# Altium schematic sheet downloader.SchDoc
size A3; SheetNumber: 1; SheetTotal: 1
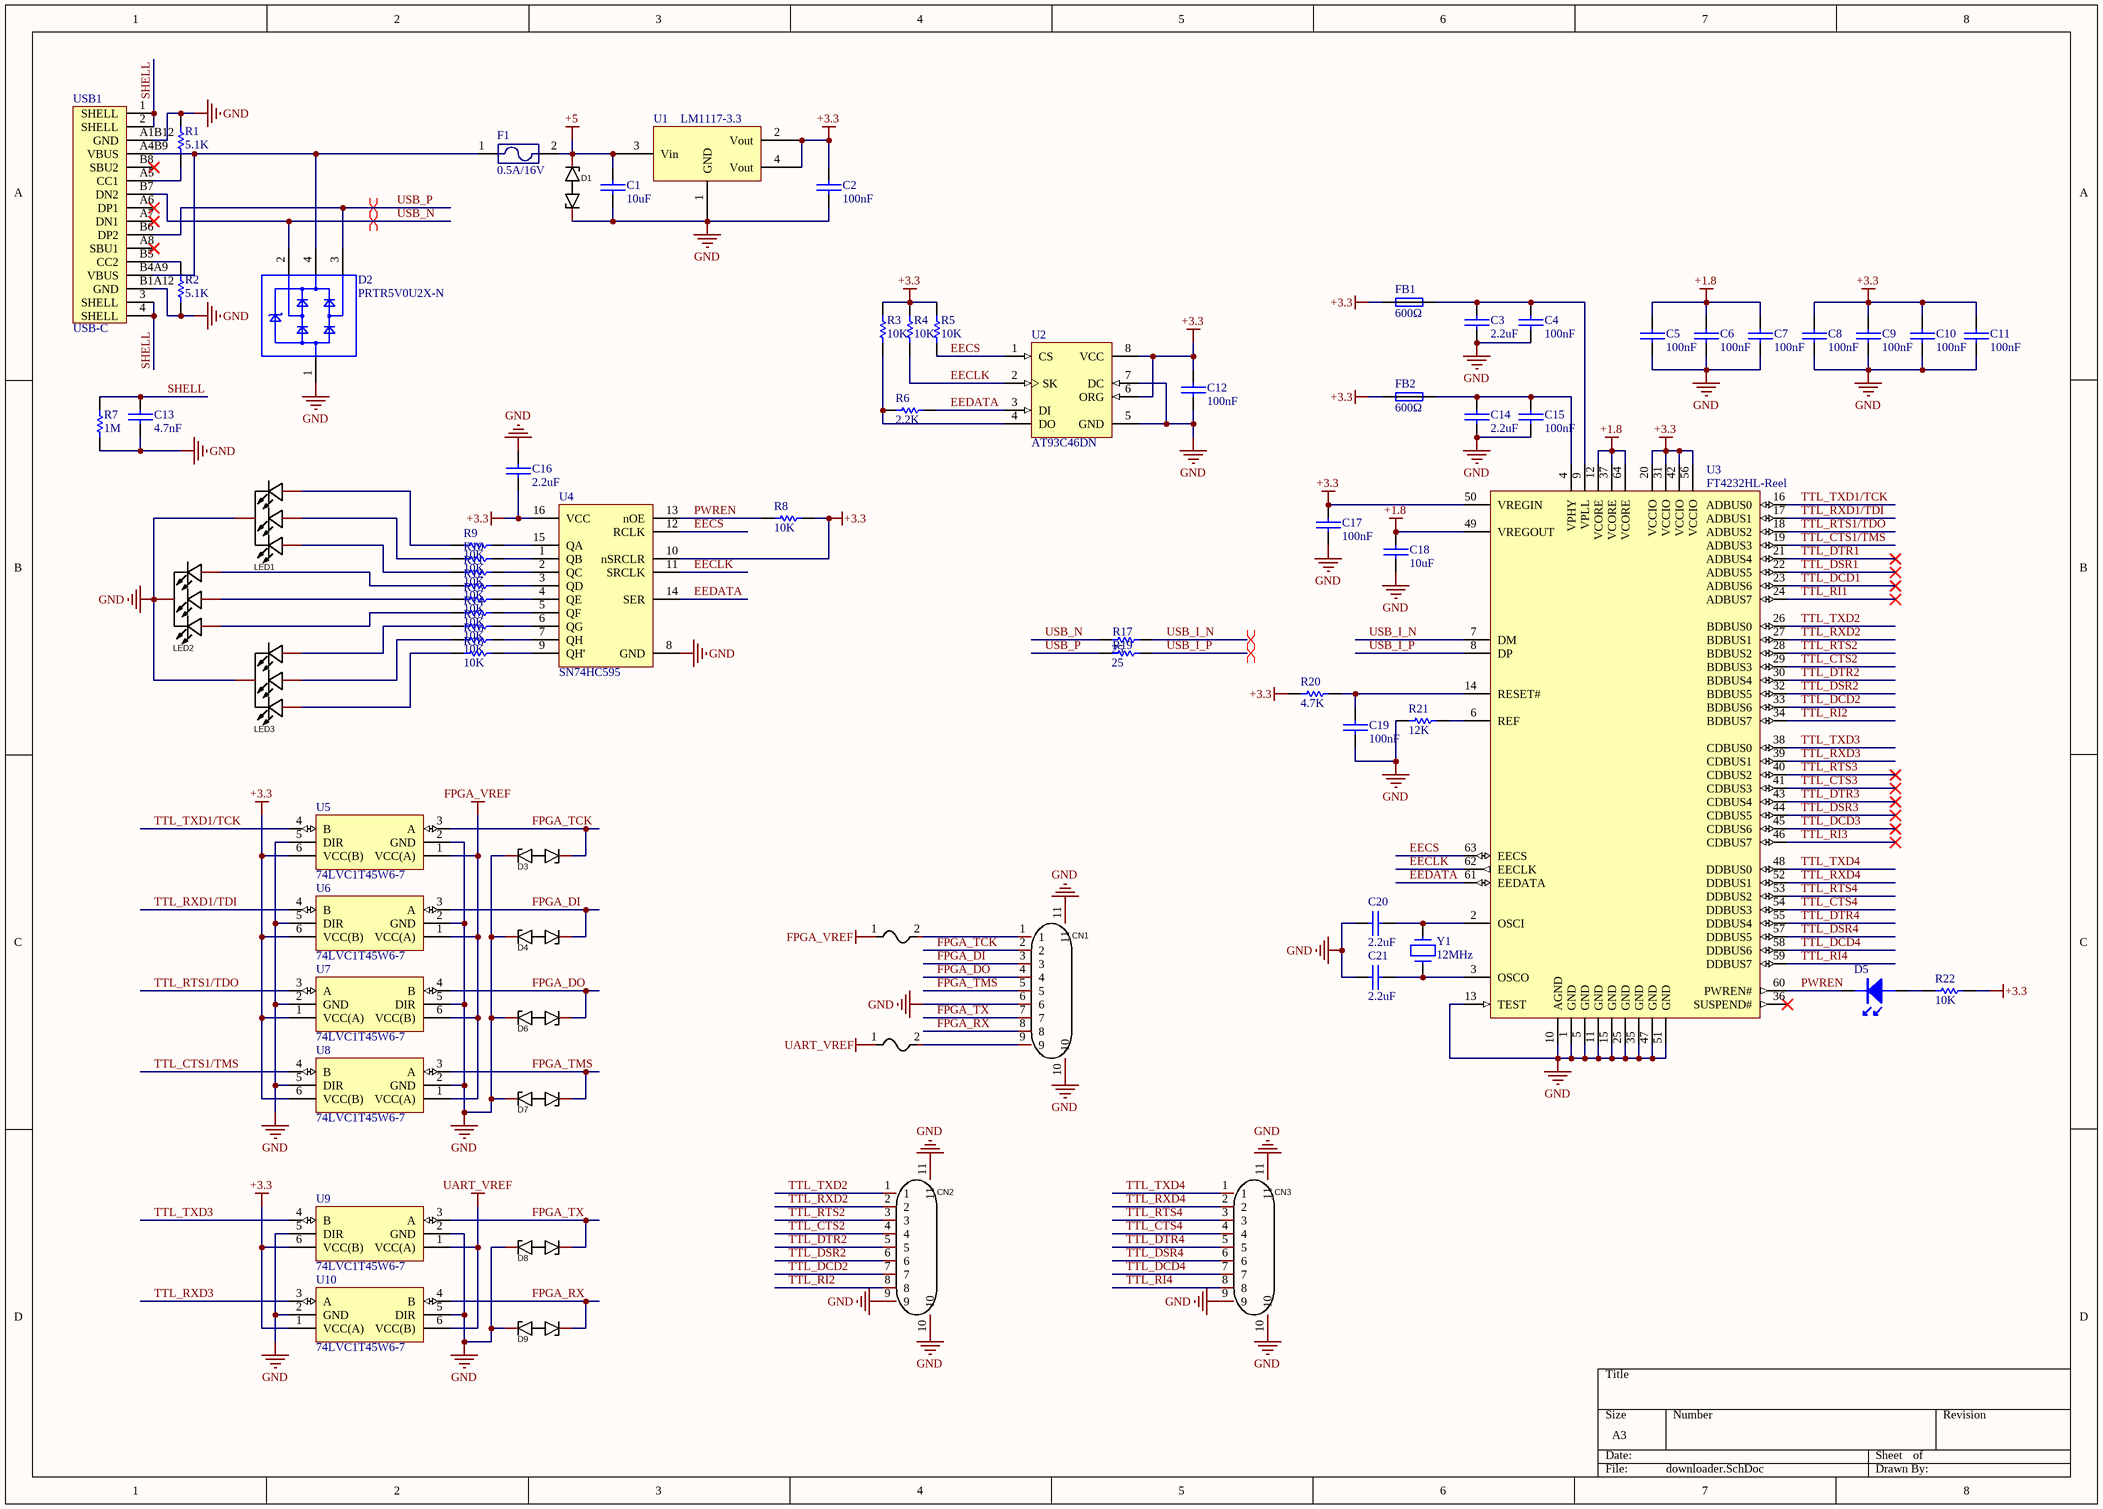
[diagram p0: downloader.SchDoc]

## Parts
C1  10uF  [CAP-0603]
C2  100nF  [CAP-0603]
C3  2.2uF  [CAP-0603]
C4  100nF  [CAP-0603]
C5  100nF  [CAP-0603]
C6  100nF  [CAP-0603]
C7  100nF  [CAP-0603]
C8  100nF  [CAP-0603]
C9  100nF  [CAP-0603]
C10  100nF  [CAP-0603]
C11  100nF  [CAP-0603]
C12  100nF  [CAP-0603]
C13  4.7nF  [CAP-0603]
C14  2.2uF  [CAP-0603]
C15  100nF  [CAP-0603]
C16  2.2uF  [CAP-0603]
C17  100nF  [CAP-0603]
C18  10uF  [CAP-0603]
C19  100nF  [CAP-0603]
C20  2.2uF  [CAP-0603]
C21  2.2uF  [CAP-0603]
CN1  1.25-9PWT  [CONN-SMD_1.25-9PWT]  (value not drawn)
CN2  1.25-9PWT  [CONN-SMD_1.25-9PWT]  (value not drawn)
CN3  1.25-9PWT  [CONN-SMD_1.25-9PWT]  (value not drawn)
D1  PESD5V0S1BA,115  [SOD-323]  (value not drawn)
D2  PRTR5V0U2X-N  [SOT-143]
D3  PESD5V0S1BA,115  [SOD-323]  (value not drawn)
D4  PESD5V0S1BA,115  [SOD-323]  (value not drawn)
D5  (no value)  [LED-0603]
D6  PESD5V0S1BA,115  [SOD-323]  (value not drawn)
D7  PESD5V0S1BA,115  [SOD-323]  (value not drawn)
D8  PESD5V0S1BA,115  [SOD-323]  (value not drawn)
D9  PESD5V0S1BA,115  [SOD-323]  (value not drawn)
F1  0.5A/16V  [F-1206]
F2  BSMD0805-050-6V  [F-0805]  (value not drawn)
F3  BSMD0805-050-6V  [F-0805]  (value not drawn)
FB1  600Ω  [FB-0603]
FB2  600Ω  [FB-0603]
LED1  TJ-S1615CY6TGLCCSRGB-A5  [LED-SMD_4P]  (value not drawn)
LED2  TJ-S1615CY6TGLCCSRGB-A5  [LED-SMD_4P]  (value not drawn)
LED3  TJ-S1615CY6TGLCCSRGB-A5  [LED-SMD_4P]  (value not drawn)
R1  5.1K  [RES-0603]
R2  5.1K  [RES-0603]
R3  10K  [RES-0603]
R4  10K  [RES-0603]
R5  10K  [RES-0603]
R6  2.2K  [RES-0603]
R7  1M  [RES-0603]
R8  10K  [RES-0603]
R9  10K  [RES-0603]
R10  10K  [RES-0603]
R11  10K  [RES-0603]
R12  10K  [RES-0603]
R13  10K  [RES-0603]
R14  10K  [RES-0603]
R15  10K  [RES-0603]
R16  10K  [RES-0603]
R17  25  [RES-0603]
R18  10K  [RES-0603]
R19  25  [RES-0603]
R20  4.7K  [RES-0603]
R21  12K  [RES-0603]
R22  10K  [RES-0603]
U1  LM1117-3.3  [SOT-223]
U2  AT93C46DN  [SO-8]
U3  FT4232HL-Reel  [LQFP-64]
U4  SN74HC595  [SO-16]
U5  74LVC1T45W6-7  [SOT-23-6]
U6  74LVC1T45W6-7  [SOT-23-6]
U7  74LVC1T45W6-7  [SOT-23-6]
U8  74LVC1T45W6-7  [SOT-23-6]
U9  74LVC1T45W6-7  [SOT-23-6]
U10  74LVC1T45W6-7  [SOT-23-6]
USB1  USB-C  [USB-C]
Y1  12MHz  [XTAL-49/S_N]

## Nets
+1.8: C5.2 C6.2 C7.2 C18.2 U3.12(VCORE) U3.37(VCORE) U3.49(VREGOUT) U3.64(VCORE)
+3.3: C2.2 C8.2 C9.2 C10.2 C11.2 C12.2 C16.2 C17.2 FB1.1 FB2.1 R3.1 R4.1 R5.1 R8.2 R20.1 R22.2 U1.2(Vout) U1.4(Vout) U2.6(ORG) U2.8(VCC) U3.20(VCCIO) U3.31(VCCIO) U3.42(VCCIO) U3.50(VREGIN) U3.56(VCCIO) U4.10(nSRCLR) U4.16(VCC) U5.6(VCC(B)) U6.6(VCC(B)) U7.1(VCC(A)) U8.6(VCC(B)) U9.6(VCC(B)) U10.1(VCC(A))
+5: C1.2 D1.2 F1.2 U1.3(Vin)
FPGA_VREF: F2.1 U5.1(VCC(A)) U6.1(VCC(A)) U7.6(VCC(B)) U8.1(VCC(A))
GND: C1.1 C2.1 C3.1 C4.1 C5.1 C6.1 C7.1 C8.1 C9.1 C10.1 C11.1 C12.1 C13.1 C14.1 C15.1 C16.1 C17.1 C18.1 C19.1 C20.1 C21.1 CN1.6 CN1.10 CN1.11 CN2.9 CN2.10 CN2.11 CN3.9 CN3.10 CN3.11 D1.1 D2.1 D3.1 D4.1 D6.1 D7.1 D8.1 D9.1 LED1.1(C) LED2.1(C) LED3.1(C) R1.2 R2.1 R7.1 R21.1 U1.1(GND) U2.5(GND) U2.7(DC) U3.1(GND) U3.5(GND) U3.10(AGND) U3.11(GND) U3.13(TEST) U3.15(GND) U3.25(GND) U3.35(GND) U3.47(GND) U3.51(GND) U4.8(GND) U5.2(GND) U5.5(DIR) U6.2(GND) U6.5(DIR) U7.2(GND) U7.5(DIR) U8.2(GND) U8.5(DIR) U9.2(GND) U9.5(DIR) U10.2(GND) U10.5(DIR) USB1.A1B12(GND) USB1.B1A12(GND)
UART_VREF: F3.1 U9.1(VCC(A)) U10.6(VCC(B))
EECLK: R4.2 U2.2(SK) U3.62(EECLK) U4.11(SRCLK)
EECS: R5.2 U2.1(CS) U3.63(EECS) U4.12(RCLK)
EEDATA: R6.2 U2.3(DI) U3.61(EEDATA) U4.14(SER)
FPGA_DI: CN1.3 D4.2 U6.3(A)
FPGA_DO: CN1.4 D6.2 U7.4(B)
FPGA_RX: CN1.8 D9.2 U10.4(B)
FPGA_TCK: CN1.2 D3.2 U5.3(A)
FPGA_TMS: CN1.5 D7.2 U8.3(A)
FPGA_TX: CN1.7 D8.2 U9.3(A)
PWREN: D5.1 R8.1 U3.60(PWREN#) U4.13(nOE)
SHELL: C13.2 R7.2 USB1.1(SHELL) USB1.2(SHELL) USB1.3(SHELL) USB1.4(SHELL)
TTL_CTS1/TMS: U3.19(ADBUS3) U8.4(B)
TTL_CTS2: CN2.4 U3.29(BDBUS3)
TTL_CTS3: U3.41(CDBUS3)
TTL_CTS4: CN3.4 U3.54(DDBUS3)
TTL_DCD1: U3.23(ADBUS6)
TTL_DCD2: CN2.7 U3.33(BDBUS6)
TTL_DCD3: U3.45(CDBUS6)
TTL_DCD4: CN3.7 U3.58(DDBUS6)
TTL_DSR1: U3.22(ADBUS5)
TTL_DSR2: CN2.6 U3.32(BDBUS5)
TTL_DSR3: U3.44(CDBUS5)
TTL_DSR4: CN3.6 U3.57(DDBUS5)
TTL_DTR1: U3.21(ADBUS4)
TTL_DTR2: CN2.5 U3.30(BDBUS4)
TTL_DTR3: U3.43(CDBUS4)
TTL_DTR4: CN3.5 U3.55(DDBUS4)
TTL_RI1: U3.24(ADBUS7)
TTL_RI2: CN2.8 U3.34(BDBUS7)
TTL_RI3: U3.46(CDBUS7)
TTL_RI4: CN3.8 U3.59(DDBUS7)
TTL_RTS1/TDO: U3.18(ADBUS2) U7.3(A)
TTL_RTS2: CN2.3 U3.28(BDBUS2)
TTL_RTS3: U3.40(CDBUS2)
TTL_RTS4: CN3.3 U3.53(DDBUS2)
TTL_RXD1/TDI: U3.17(ADBUS1) U6.4(B)
TTL_RXD2: CN2.2 U3.27(BDBUS1)
TTL_RXD3: U3.39(CDBUS1) U10.3(A)
TTL_RXD4: CN3.2 U3.52(DDBUS1)
TTL_TXD1/TCK: U3.16(ADBUS0) U5.4(B)
TTL_TXD2: CN2.1 U3.26(BDBUS0)
TTL_TXD3: U3.38(CDBUS0) U9.4(B)
TTL_TXD4: CN3.1 U3.48(DDBUS0)
USB_I_N: R17.2 U3.7(DM)
USB_I_P: R19.2 U3.8(DP)
USB_N: D2.2 R17.1 USB1.B7(DN2)
USB_P: D2.3 R19.1 USB1.B6(DP2)
NetC3_2: C3.2 C4.2 FB1.2 U3.9(VPLL)
NetC14_2: C14.2 C15.2 FB2.2 U3.4(VPHY)
NetC19_2: C19.2 R20.2 U3.14(RESET#)
NetC20_2: C20.2 U3.2(OSCI) Y1.2
NetC21_2: C21.2 U3.3(OSCO) Y1.1
NetCN1_1: CN1.1 F2.2
NetCN1_9: CN1.9 F3.2
NetD2_4: D2.4 F1.1 USB1.A4B9(VBUS) USB1.B4A9(VBUS)
NetD5_2: D5.2 R22.1
NetLED1_2: LED1.2(B) R11.1
NetLED1_3: LED1.3(G) R10.1
NetLED1_4: LED1.4(R) R9.1
NetLED2_2: LED2.2(B) R14.1
NetLED2_3: LED2.3(G) R13.1
NetLED2_4: LED2.4(R) R12.1
NetLED3_2: LED3.2(B) R18.1
NetLED3_3: LED3.3(G) R16.1
NetLED3_4: LED3.4(R) R15.1
NetR1_1: R1.1 USB1.A5(CC1)
NetR2_2: R2.2 USB1.B5(CC2)
NetR3_2: R3.2 R6.1 U2.4(DO)
NetR9_2: R9.2 U4.15(QA)
NetR10_2: R10.2 U4.1(QB)
NetR11_2: R11.2 U4.2(QC)
NetR12_2: R12.2 U4.3(QD)
NetR13_2: R13.2 U4.4(QE)
NetR14_2: R14.2 U4.5(QF)
NetR15_2: R15.2 U4.6(QG)
NetR16_2: R16.2 U4.7(QH)
NetR18_2: R18.2 U4.9(QH')
NetR21_2: R21.2 U3.6(REF)

Not connected (* = marked no-connect by the designer): U3 36(SUSPEND#)*; USB1 A6(DP1)* A7(DN1)* A8(SBU1)* B8(SBU2)*

## Layout directives
differential pair: USB_I_N, USB_I_P, USB_N, USB_P

## Library data of the parts
C1 C2 C4-C12 C15 C17 C18 = CAP0603: 存货编码: Cap-0603-2.2uF; 序号: 690; 存货名称: 贴片电容; 规格型号: 2.2uF ±10%; 最新成本: NC; value: 2.2uF; 产地品牌: NC
C3 C14 = CAP0603: 存货编码: Cap-0603-2.2uF; 序号: 690; 存货名称: 贴片电容; 规格型号: 2.2uF ±10%; 最新成本: NC; 产地品牌: NC; value: 2.2uF
C13 C19 = CAP-0603: 存货编码: Cap-0603-2.2uF; 序号: 690; 存货名称: 贴片电容; 规格型号: 2.2uF ±10%; 最新成本: NC; value: 2.2uF; 产地品牌: NC
C16 C20 C21 = CAP-0603: 存货编码: Cap-0603-2.2uF; 序号: 690; 存货名称: 贴片电容; 规格型号: 2.2uF ±10%; 最新成本: NC; 产地品牌: NC; value: 2.2uF
CN1-CN3 = 1.25-9PWT: Manufacturer: FG(富港); Add into BOM: yes; Name: 1.25-9PWT; Symbol: 1.25-9PWT; Device: 1.25-9PWT; LCSC Part Name: 9P 1.25mm; Supplier Part: C2763637; Manufacturer Part: 1.25-9PWT; Supplier Footprint: SMD; JLCPCB Part Class: Extended Part; Datasheet: https://atta.szlcsc.com/upload/public/pdf/source/20210407/C2763630_1F55A4CF96FF27F08DE8CC60DA29871C.pdf; Supplier: LCSC; Convert to PCB: yes
D1 D3 D4 D6-D9 = PESD5V0S1BA: 115; Manufacturer: Nexperia(安世); Add into BOM: yes; polarity: 双向; Reverse Stand-Off Voltage (Vrwm): 5V; Maximum Clamping Voltage: 14V; Peak Pulse Current (Ipp)@10/1000us: 12A; Peak Pulse Power Dissipation (Ppp)@10/1000us: 130W; Breakdown Voltage: 5.5V; Type: TVS; Name: PESD5V0S1BA,115; Symbol: PESD5V0S1BA,115; Device: PESD5V0S1BA,115; LCSC Part Name: PESD5V0S1BA,115; Supplier Part: C19224; Manufacturer Part: PESD5V0S1BA,115; Supplier Footprint: SOD-323; JLCPCB Part Class: Extended Part; Datasheet: https://atta.szlcsc.com/upload/public/pdf/source/20161024/1477288630856.pdf; Supplier: LCSC; Convert to PCB: yes
D2 = PRTR5V0U2X-N: USB2.0-ESD; 序号: 1156; 存货名称: USB2.0-ESD器件; 最新成本: NC; 存货编码: PRTR5V0U2X-N; 规格型号: PRTR5V0U2X-N; 产地品牌: NC; value: PRTR5V0U2X-N
D5 = LED-0603: 存货编码: LED0603-R; 序号: 805; 存货名称: 发光二极管; 规格型号: 0603贴片; 最新成本: NC; value: 红色; 产地品牌: NC
F1 = RE-FUSE: 存货编码: 可恢复保险0.5A/16V; 序号: 866; 存货名称: 可恢复保险; 最新成本: NC; 规格型号: 0.5A/16V; 产地品牌: NC; value: 0.5A/16V
F2 F3 = BSMD0805: 050-6V; Manufacturer: BHFUSE(佰宏); Add into BOM: yes; Operating Voltage (Max): 6V; Current Rating (Max): 40A; Hold Current: 500mA; Trip Current: 1A; Power Dissipation: 500mW; Resistance - Initial (Ri) (Min): 100mΩ; Resistance - Post Trip (R1) (Max): 850mΩ; Maximum Time to Trip: 100ms; Name: BSMD0805-050-6V; Symbol: BSMD0805-050-6V; Device: BSMD0805-050-6V; LCSC Part Name: 6V 500mA 0805自恢复; Supplier Part: C883108; Manufacturer Part: BSMD0805-050-6V; Supplier Footprint: 0805; JLCPCB Part Class: Extended Part; Datasheet: https://atta.szlcsc.com/upload/public/pdf/source/20230512/7A46D6CD923C15CBB98FD769C08EDD80.pdf; Supplier: LCSC; Convert to PCB: yes; Operating Temperature: -40℃~+85℃
FB1 FB2 = FB0603: 存货编码: FB-0603-600Ω; 序号: 863; 存货名称: 贴片磁珠; 规格型号: 600Ω ±25% 400mA; 最新成本: NC; 产地品牌: NC; value: 600Ω
LED1-LED3 = TJ-S1615CY6TGLCCSRGB-A5: Manufacturer: TOGIALED(统佳); Add into BOM: yes; Name: TJ-S1615CY6TGLCCSRGB-A5; Symbol: TJ-S1615CY6TGLCCSRGB-A5; Device: TJ-S1615CY6TGLCCSRGB-A5; LCSC Part Name: RGB三色; Supplier Part: C601684; Manufacturer Part: TJ-S1615CY6TGLCCSRGB-A5; Supplier Footprint: 0606; JLCPCB Part Class: Extended Part; Datasheet: https://atta.szlcsc.com/upload/public/pdf/source/20200618/C601684_45CF7DB80FE0981E5EA474618D8F7AF5.pdf; Supplier: LCSC; Convert to PCB: yes
R1-R22 = RES-0603: 存货编码: RES-0603-0; 序号: 171; 存货名称: 贴片电阻; 规格型号: 0Ω ±1%; 最新成本: NC; value: 0Ω; 产地品牌: NC
U1 = LM1117-3.3: LDO; 序号: 4; 存货名称: IC; 规格型号: LDO,IN 4.8~12V; 最新成本: NC; 存货编码: LM1117-3.3; value: LM1117-3.3; 产地品牌: NC
U2 = AT93C46DN: 序号: 92; 存货名称: IC; 最新成本: NC; 存货编码: AT93C46DN; value: AT93C46DN; 规格型号: AT93C46DN; 产地品牌: NC
U3 = FT4232HL-Reel: Quad High Speed USB To Multipurpose UART/MPSSE IC, LQFP-64, Tape and Reel; Published: 19-Aug-2010; DatasheetVersion: ver 2.08, May-2010; PackageVersion: 2010; PackageReference: LQFP-64; Publisher: Altium Limited; PackageDescription: 64-Pin Thin Quad Flat Pack, 10 x 10 x 1.4 mm Body, 0.5 mm Pitch; ComponentLink1Description: Manufacturer Link; ComponentLink1URL: http://www.ftdichip.com/Products/ICs/FT4232H.htm; ComponentLink2Description: Datasheet; ComponentLink2URL: http://www.ftdichip.com/Support/Documents/DataSheets/ICs/DS_FT4232H.pdf
U4 = SN74HC595: 序号: 93; 存货名称: IC; 最新成本: NC; 存货编码: SN74HC595; value: SN74HC595; 规格型号: SN74HC595; 产地品牌: NC
USB1 = USB-C-16P: 16P
Y1 = XTAL-49/S_N: 存货编码: XTAL-49/S_N-12MHz; 序号: 838; 存货名称: 晶体; 最新成本: NC; 规格型号: 12MHz; 产地品牌: NC; value: 12MHz